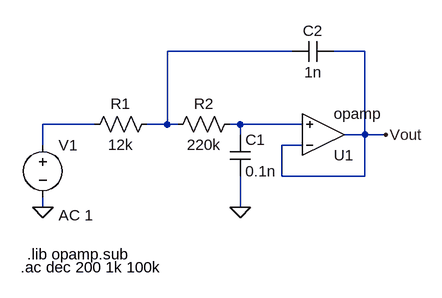
[diagram p0: schematic SallenKey_LP_BW.asc]
SallenKey_LP_BW.asc, the LTspice schematic file:
Version 4
SHEET 1 880 680
WIRE 208 64 16 64
WIRE 320 64 272 64
WIRE -96 176 -176 176
WIRE 16 176 16 64
WIRE 16 176 -16 176
WIRE 32 176 16 176
WIRE 128 176 112 176
WIRE 224 176 128 176
WIRE 128 192 128 176
WIRE 320 192 320 64
WIRE 320 192 288 192
WIRE 352 192 320 192
WIRE -176 208 -176 176
WIRE 224 208 192 208
WIRE 192 256 192 208
WIRE 320 256 320 192
WIRE 320 256 192 256
WIRE -176 304 -176 288
WIRE 128 304 128 256
FLAG 128 304 0
FLAG -176 304 0
FLAG 352 192 Vout
SYMBOL cap 112 192 R0
SYMATTR InstName C1
SYMATTR Value 0.1n
SYMBOL cap 272 48 R90
WINDOW 0 0 32 VBottom 2
WINDOW 3 32 32 VTop 2
SYMATTR InstName C2
SYMATTR Value 1n
SYMBOL res 0 160 R90
WINDOW 0 0 56 VBottom 2
WINDOW 3 32 56 VTop 2
SYMATTR InstName R1
SYMATTR Value 12k
SYMBOL res 128 160 R90
WINDOW 0 0 56 VBottom 2
WINDOW 3 32 56 VTop 2
SYMATTR InstName R2
SYMATTR Value 220k
SYMBOL OpAmps\\opamp 256 256 M180
SYMATTR InstName U1
SYMBOL voltage -176 192 R0
WINDOW 123 24 124 Left 2
WINDOW 39 0 0 Left 0
SYMATTR InstName V1
SYMATTR Value ""
SYMATTR Value2 AC 1
TEXT -200 376 Left 2 !.lib opamp.sub
TEXT -210 396 Left 2 !.ac dec 200 1k 100k

The netlist it stands for:
* SallenKey_LP_BW.asc
C1 N003 0 0.1n
C2 Vout N001 1n
R1 N001 N002 12k
R2 N003 N001 220k
XU1 Vout N003 Vout opamp Aol=100K GBW=10Meg  ; pins invin noninvin out
V1 N002 0 AC 1
.lib opamp.sub
.ac dec 200 1k 100k
.backanno
.end